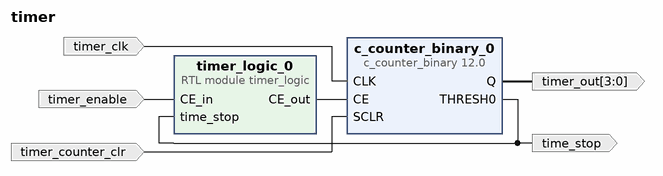
[diagram p0: block diagram of the top level]
# Vivado block design timer, xc7z020clg484-1, Vivado 2024.2
create_bd_design timer

create_bd_port -dir O -type data time_stop
create_bd_port -dir O -from 3 -to 0 -type data timer_out
create_bd_port -dir I -type data timer_clk
create_bd_port -dir I -type data timer_counter_clr
create_bd_port -dir I -type data timer_enable

create_bd_cell -type ip -vlnv xilinx.com:ip:c_counter_binary:12.0 c_counter_binary_0
set_property -dict [list \
  CONFIG.CE true \
  CONFIG.Fb_Latency_Configuration Automatic \
  CONFIG.Final_Count_Value E \
  CONFIG.Implementation DSP48 \
  CONFIG.Latency_Configuration Automatic \
  CONFIG.Load_Sense Active_High \
  CONFIG.Output_Width 4 \
  CONFIG.Restrict_Count true \
  CONFIG.SCLR true \
  CONFIG.Sync_CE_Priority Sync_Overrides_CE \
  CONFIG.Sync_Threshold_Output true \
] [get_bd_cells c_counter_binary_0]
create_bd_cell -type module -reference timer_logic timer_logic_0

# ---- connections ----

connect_bd_net -net CE_1 [get_bd_ports timer_enable] [get_bd_pins timer_logic_0/CE_in]
connect_bd_net -net CLK_1 [get_bd_ports timer_clk] [get_bd_pins c_counter_binary_0/CLK]
connect_bd_net -net SCLR_1 [get_bd_ports timer_counter_clr] [get_bd_pins c_counter_binary_0/SCLR]
connect_bd_net [get_bd_pins c_counter_binary_0/Q] [get_bd_ports timer_out]
connect_bd_net [get_bd_pins c_counter_binary_0/THRESH0] [get_bd_ports time_stop] [get_bd_pins timer_logic_0/time_stop]
connect_bd_net [get_bd_pins timer_logic_0/CE_out] [get_bd_pins c_counter_binary_0/CE]

validate_bd_design
save_bd_design
